# EAGLE design MON-PCP-2-2 (EAGLE 9.6.2)
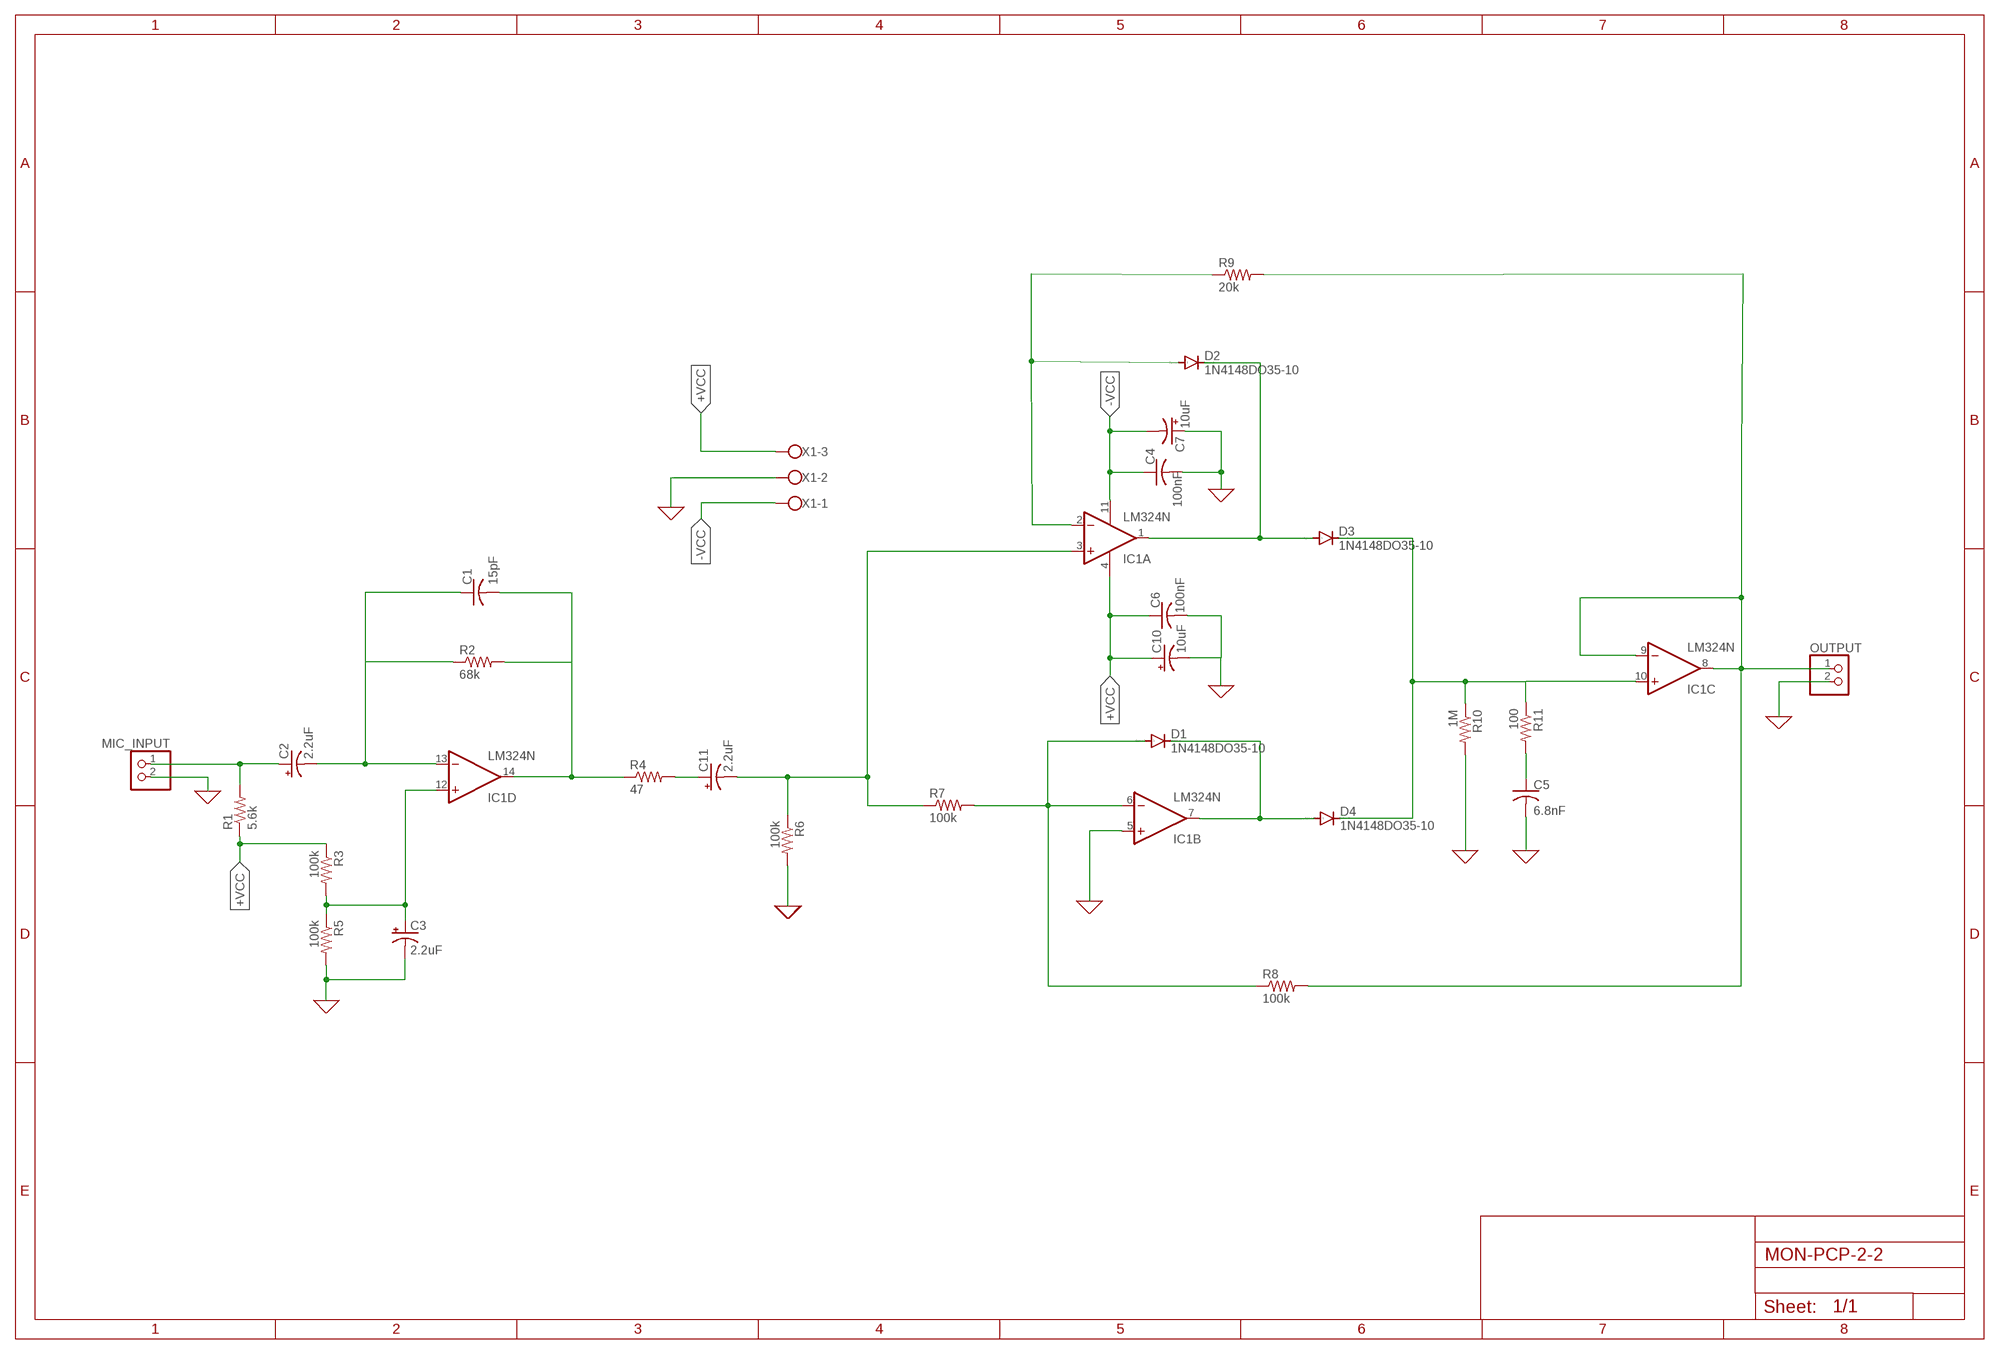
[diagram p0: schematic, sheet 1]

## Parts
C1  15pF  C-US050-025X075  [C050-025X075]
C2  2.2uF  CPOL-USE2.5-7  [E2,5-7]
C3  2.2uF  CPOL-USE2.5-7  [E2,5-7]
C4  100nF  C-US050-025X075  [C050-025X075]
C5  6.8nF  C-US050-025X075  [C050-025X075]
C6  100nF  C-US050-025X075  [C050-025X075]
C7  10uF  CPOL-USE2.5-7  [E2,5-7]
C10  10uF  CPOL-USE2.5-7  [E2,5-7]
C11  2.2uF  CPOL-USE2.5-7  [E2,5-7]
D1  1N4148DO35-10  [DO35-10]
D2  1N4148DO35-10  [DO35-10]
D3  1N4148DO35-10  [DO35-10]
D4  1N4148DO35-10  [DO35-10]
IC1  LM324N  [DIL14]
MIC_INPUT  PINHD-1X2  [1X02]
OUTPUT  PINHD-1X2  [1X02]
R1  5.6k  R-US_0207/10  [0207/10]
R2  68k  R-US_0207/10  [0207/10]
R3  100k  R-US_0207/10  [0207/10]
R4  47  R-US_0207/10  [0207/10]
R5  100k  R-US_0207/10  [0207/10]
R6  100k  R-US_0207/10  [0207/10]
R7  100k  R-US_0207/10  [0207/10]
R8  100k  R-US_0207/10  [0207/10]
R9  20k  R-US_0207/10  [0207/10]
R10  1M  R-US_0207/10  [0207/10]
R11  100  R-US_0207/10  [0207/10]
X1  W237-103  [W237-103]

## Nets
0: C3.- C4.2 C5.2 C6.2 C7.+ C10.- IC1.5(B:+IN) MIC_INPUT.2 OUTPUT.2 R5.2 R6.2 R10.2 X1.2 ; supply symbol labelled GND
+VCC: C6.1 C10.+ IC1.4(P:V+) R1.1 R3.1 X1.3
-VCC: C4.1 C7.- IC1.11(P:V-) X1.1
N$1: D1.A IC1.6(B:-IN) R7.2 R8.1
N$2: C3.+ IC1.12(D:+IN) R3.2 R5.1
N$3: C1.1 C2.- IC1.13(D:-IN) R2.1
N$4: C11.+ R4.2
N$5: C1.2 IC1.14(D:OUT) R2.2 R4.1
N$6: C11.- IC1.3(A:+IN) R6.1 R7.1
N$7: D1.C D4.A IC1.7(B:OUT)
N$11: D2.C D3.A IC1.1(A:OUT)
N$12: D3.C D4.C IC1.10(C:+IN) R10.1 R11.1
N$13: C5.1 R11.2
N$17: D2.A IC1.2(A:-IN) R9.1
VIN: C2.+ MIC_INPUT.1 R1.2
VOUT: IC1.8(C:OUT) IC1.9(C:-IN) OUTPUT.1 R8.2 R9.2

## Library data of the parts
C1 C4-C6 = rcl:C-US: CAPACITOR, American symbol; SPICEPREFIX: C
C2 C3 C7 C10 C11 = rcl:CPOL-US: POLARIZED CAPACITOR, American symbol; SPICEPREFIX: C
D1-D4 = diode:1N4148: DIODE high speed (Philips)
IC1 = linear:LM324: OP AMP
MIC_INPUT OUTPUT = pinhead:PINHD-1X2: PIN HEADER
R1-R11 = rcl:R-US_: RESISTOR, American symbol; SPICEPREFIX: R
X1 = con-wago-500:W237-103: WAGO SCREW CLAMP; MPN: 237-103; OC_FARNELL: unknown; OC_NEWARK: 18M7116

## Board
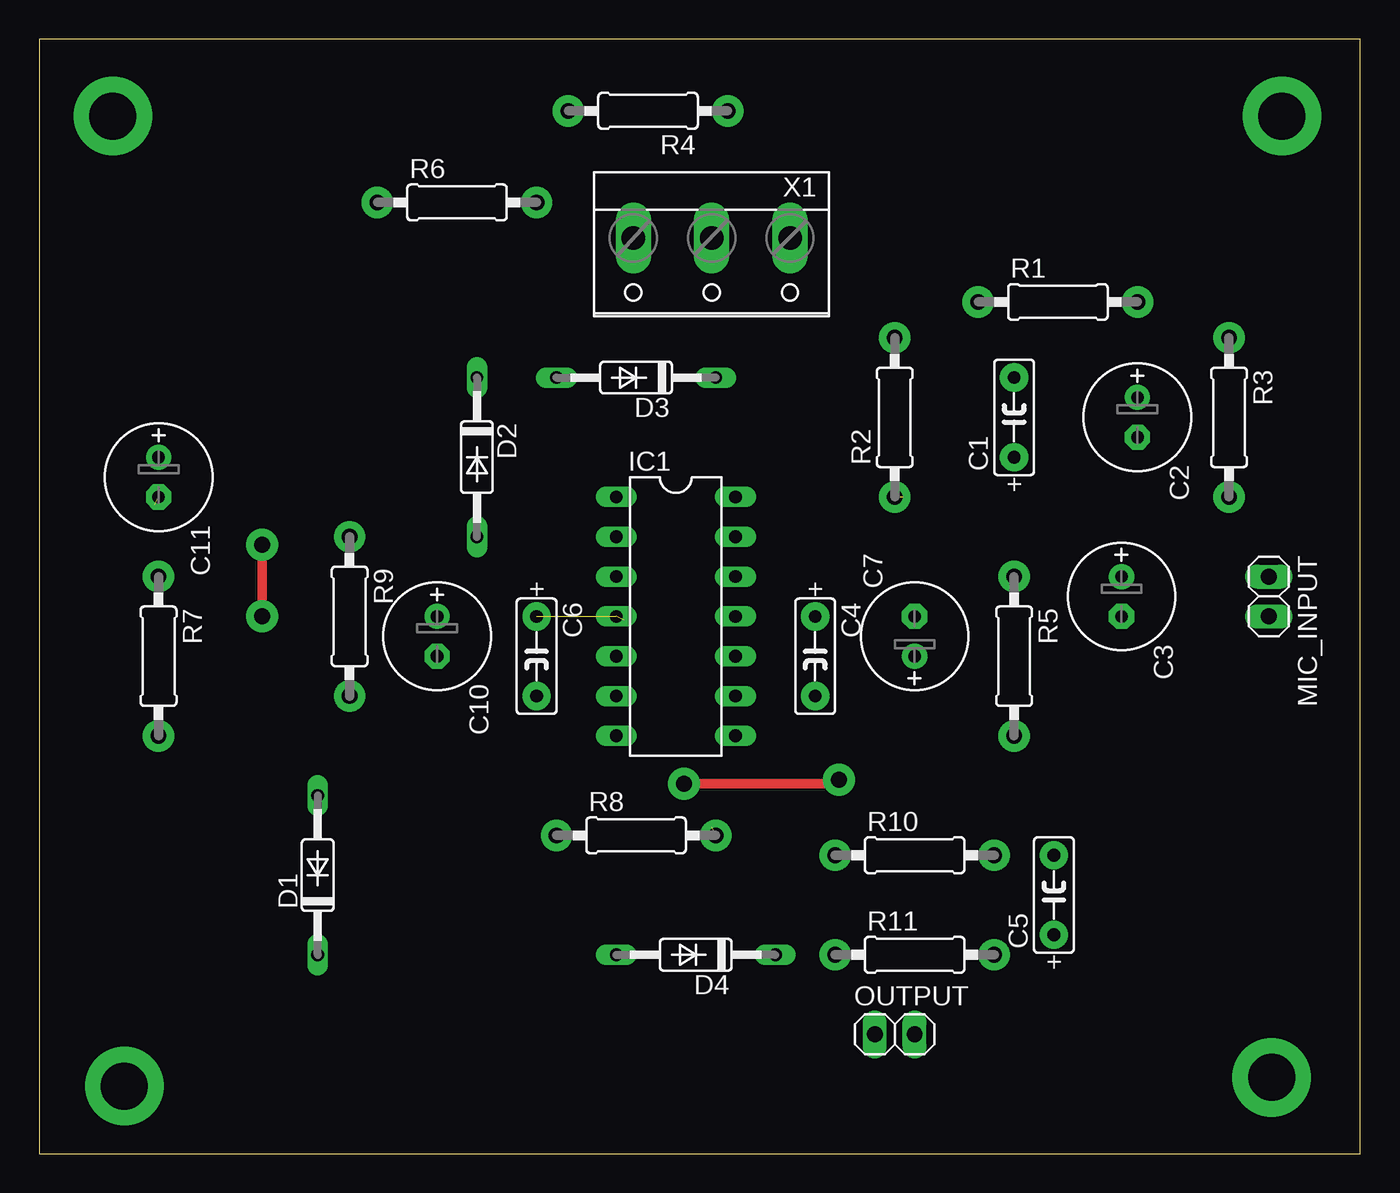
[diagram p1: board, top side]
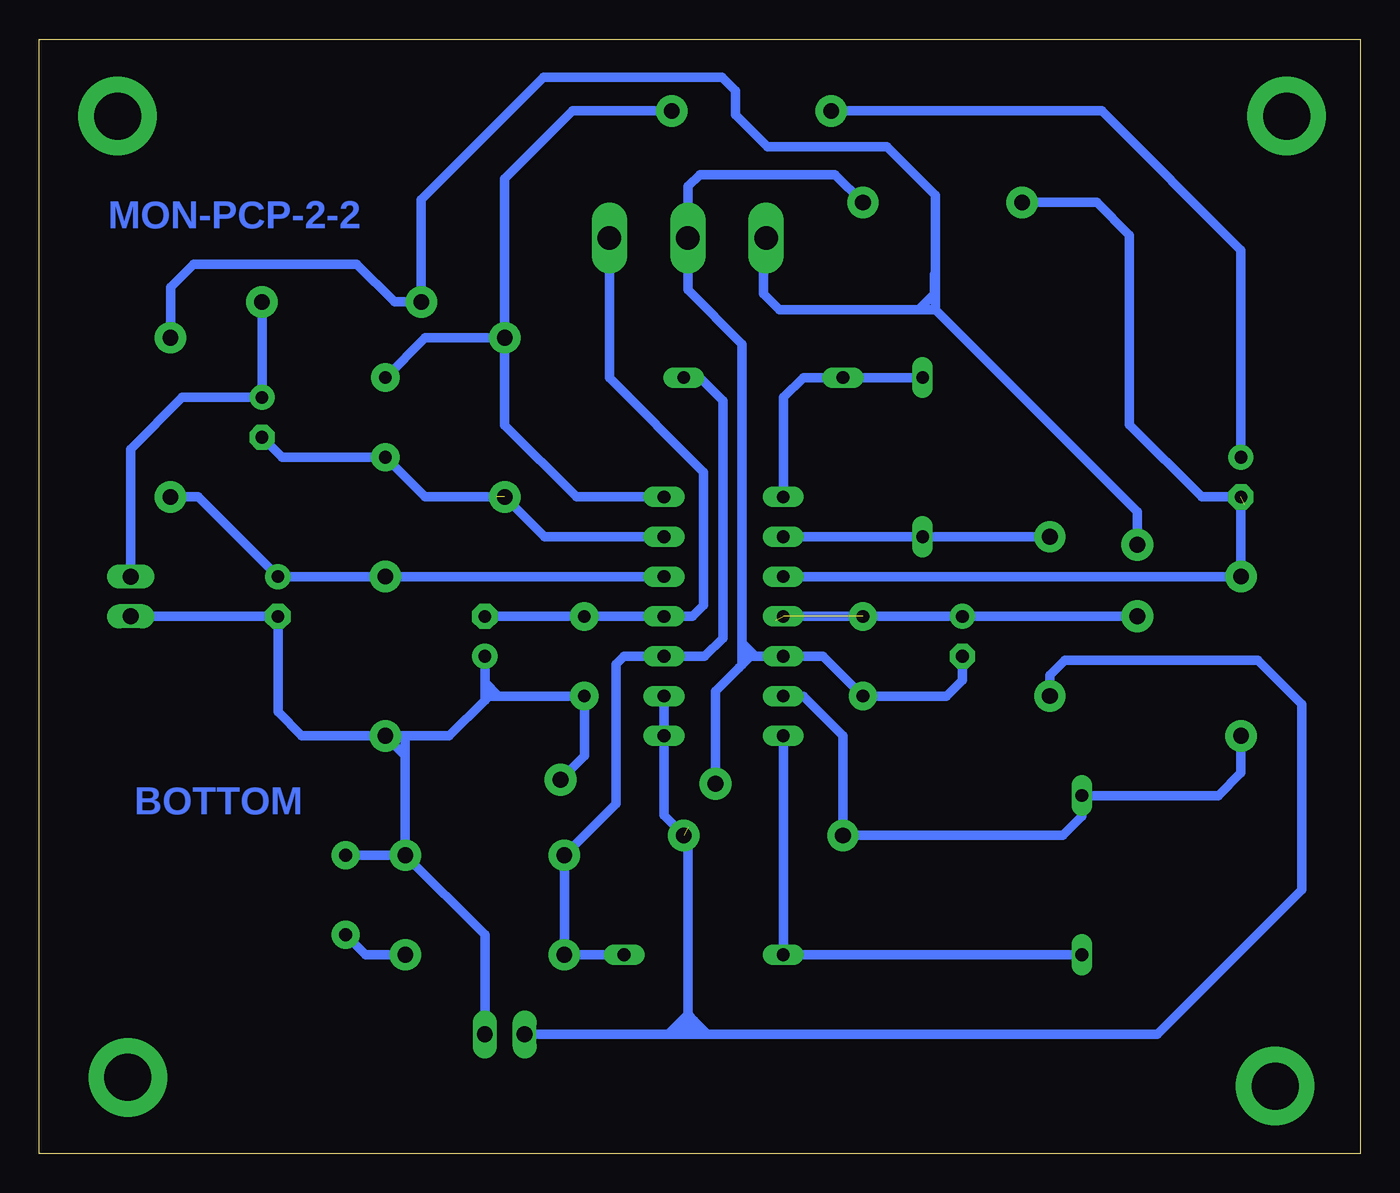
[diagram p2: board, bottom side, seen from below]

Size 84.33 x 71.12 mm. Coordinates in mm from the lower left corner, seen from the top.
Outline: 0,0 84.33,0 84.33,71.12 0,71.12 0,0
Copper layers (1*16): Top 0.035mm / dielectric 1.5mm / Bottom 0.035mm
Design rules "default *": minimum track width 16mil, minimum drill 0.35mm, track to track 24mil, track to pad 16mil, pad to pad 16mil, via to via 16mil, smd to smd 16mil, copper to edge 40mil, drill to drill 24mil, minimum pad ring 10mil, minimum via ring 8mil, stop-mask expansion 4mil, vias tented up to drill 0mil, thermal gap 10mil

### Footprints (pad centres in the part's own frame; a part is rotated, then mirrored left to right if it is on the bottom)
C050-025X075 = drill 0.813 pad 1.8: 1 -2.54,0; 2 2.54,0
E2,5-7 = drill 0.813 pad 1.6: + -1.27,0 | drill 0.813 pad 1.6 octagon: - 1.27,0
DO35-10 = drill 0.813 long: A 5.08,0; C -5.08,0
DIL14 = drill 0.813 long: 1 -7.62,-3.81; 2 -5.08,-3.81; 3 -2.54,-3.81; 4 0,-3.81; 5 2.54,-3.81; 6 5.08,-3.81; 7 7.62,-3.81; 8 7.62,3.81; 9 5.08,3.81; 10 2.54,3.81; 11 0,3.81; 12 -2.54,3.81; 13 -5.08,3.81; 14 -7.62,3.81
1X02 = drill 1.016 long: 1 -1.27,0; 2 1.27,0
0207/10 = drill 1 pad 2: 1 -5.08,0; 2 5.08,0
W237-103 = drill 1.5 long: 1 -5,-1.29; 2 0,-1.29; 3 5,-1.29

### Placement (x,y rotation side)
C1  62.23,46.99 90 top
C2  70.1,46.99 270 top
C3  69.09,35.56 270 top
C4  49.53,31.75 270 top
C5  64.77,16.51 90 top
C6  31.75,31.75 270 top
C7  55.88,33.02 90 top
C10  25.4,33.02 270 top
C11  7.62,43.18 270 top
D1  17.78,17.78 90 top
D2  27.94,44.45 270 top
D3  38.1,49.53 180 top
D4  41.91,12.7 180 top
IC1  40.64,34.29 270 top
MIC_INPUT  78.49,35.56 270 top
OUTPUT  54.61,7.62 0 top
R1  65.02,54.36 0 top
R2  54.61,46.99 90 top
R3  75.95,46.99 270 top
R4  38.86,66.55 180 top
R5  62.23,31.75 270 top
R6  26.67,60.71 0 top
R7  7.62,31.75 270 top
R8  38.1,20.32 0 top
R9  19.81,34.29 270 top
R10  55.88,19.05 0 top
R11  55.88,12.7 0 top
X1  42.93,57.15 180 top

### Tracks (layer width: path | path; a pad name or v marks a point on that pad's centre or on a via)
0  (via drill 1.02 pad 2.03)
  Top 0.61: v51.05,23.88 50.8,23.62 v41.15,23.62
  Bottom 0.406: 42.93,58.67 X1.2
  Bottom 0.61: C10.- 25.4,30.23 26.42,29.21 C6.2 34.29,31.75 IC1.5 38.61,31.75 | R10.2 55.88,13.97 OUTPUT.2 | R10.2 C5.2 | R5.2 60.96,25.4 | 60.96,25.4 R10.2 | 55.88,28.96 58.17,26.67 60.96,26.67 | 60.96,26.67 R5.2 | 60.96,25.4 60.96,26.67 | 55.88,28.96 C7.+ 55.88,30.1 54.99,29.21 | 54.99,29.21 C4.2 49.53,25.4 v51.05,23.88 | 54.99,29.21 55.63,29.21 55.88,28.96 | 39.47,32.61 39.47,51.67 42.93,55.12 42.93,58.67 42.93,61.72 42.16,62.48 33.53,62.48 R6.2 | MIC_INPUT.2 C3.- 69.09,28.19 67.56,26.67 R5.2 | v41.15,23.62 41.15,29.52 38.92,31.75 38.61,31.75 | 38.61,31.75 39.47,32.61 | 39.47,32.61 39.47,31.19 39.65,31.01
+VCC  (via drill 1.02 pad 2.03)  (2 unrouted)
  Top 0.61: 14.22,34.04 v14.22,34.29 v14.22,38.86
  Bottom 0.61: 37.34,34.04 37.08,34.29 C10.+ v14.22,34.29 | 27.12,53.85 14.22,40.95 v14.22,38.86 | 28.19,53.85 37.08,53.85 38.1,54.86 38.1,58.27 X1.3 | 28.19,53.85 27.12,53.85 | 75.96,52.08 R3.1 75.95,55.28 74.46,56.77 64.06,56.77 61.65,54.36 R1.1 59.94,60.87 52.13,68.68 40.74,68.68 39.88,67.82 39.88,66.29 37.85,64.26 30.23,64.26 27.12,61.15 27.12,53.85 | 27.18,56.13 27.18,54.86 28.19,53.85
-VCC
  Bottom 0.61: C7.- C4.1 IC1.11 42.61,34.29 41.91,34.99 41.91,43.49 47.93,49.51 X1.1
N$1
  Bottom 0.61: R7.2 7.62,24.31 9.07,22.86 D1.A 17.78,21.54 19,20.32 R8.1 33.02,26.67 35.56,29.21 IC1.6
N$2
  Bottom 0.61: IC1.12 R5.1 C3.+ 74.17,41.91 74.93,41.91 R3.2
N$3  (1 unrouted)
  Bottom 0.61: C2.- 68.83,44.45 C1.1 59.69,41.91 55.12,41.91 | IC1.13 52.07,39.37 R2.1
N$4
  Bottom 0.61: C11.+ 7.62,57.66 16.51,66.55 R4.2
N$5
  Bottom 0.61: C1.2 59.69,52.07 R2.2 | R2.2 54.61,46.48 50.04,41.91 IC1.14 | R4.1 50.29,66.55 54.61,62.23 R2.2
N$6  (1 unrouted)
  Bottom 0.61: 7.37,41.4 7.62,41.15 R7.1 IC1.3 | C11.- 10.11,41.91 14.73,46.53 14.73,58.62 16.82,60.71 R6.1
N$7
  Bottom 0.61: D1.C D4.A IC1.7
N$8  (via drill 3 pad 5)
  other vias: 4.7,66.22
N$9  (via drill 3 pad 5)
  other vias: 79.32,66.22
N$10  (via drill 3 pad 5)
  other vias: 5.44,4.32
N$11
  Bottom 0.61: D2.C D3.A 35.56,49.53 36.83,48.26 IC1.1
N$12
  Bottom 0.61: D4.C R11.1 R10.1 47.5,22.35 47.5,31.24 46.99,31.75 IC1.10 41.85,31.75 40.69,32.91 40.69,48.06 42.16,49.53 D3.C
N$13
  Bottom 0.61: C5.1 63.5,12.7 R11.2
N$14  (via drill 3 pad 5)
  other vias: 78.66,4.88
N$17
  Bottom 0.61: R9.1 D2.A IC1.2
VIN
  Bottom 0.61: 70.36,48.51 C2.+ | R1.2 C2.+ | MIC_INPUT.1 78.49,44.96 75.18,48.26 C2.+
VOUT  (1 unrouted)
  Bottom 0.61: OUTPUT.1 44.2,7.62 | 42.93,8.89 42.93,20.83 | 44.2,7.62 42.93,8.89 | R8.2 44.45,21.59 IC1.8 IC1.9 | 19.56,29.46 R9.2 19.81,30.53 18.85,31.5 6.55,31.5 3.73,28.68 3.73,16.84 12.95,7.62 41.66,7.62 | 41.66,7.62 42.52,8.48 | 42.72,8.69 42.93,8.89 | 41.66,7.62 43.79,7.62 | 44.2,7.62 43.79,7.62 | 43.79,7.62 42.72,8.69 | 42.72,8.69 42.52,8.48 | 42.52,8.48 42.52,7.64 42.55,7.64 42.93,8.03

### Text on the board
Bottom: MON-PCP-2-2 | BOTTOM